# Altium schematic sheet main.SchDoc
size A4; SheetNumber: 1; SheetTotal: 12
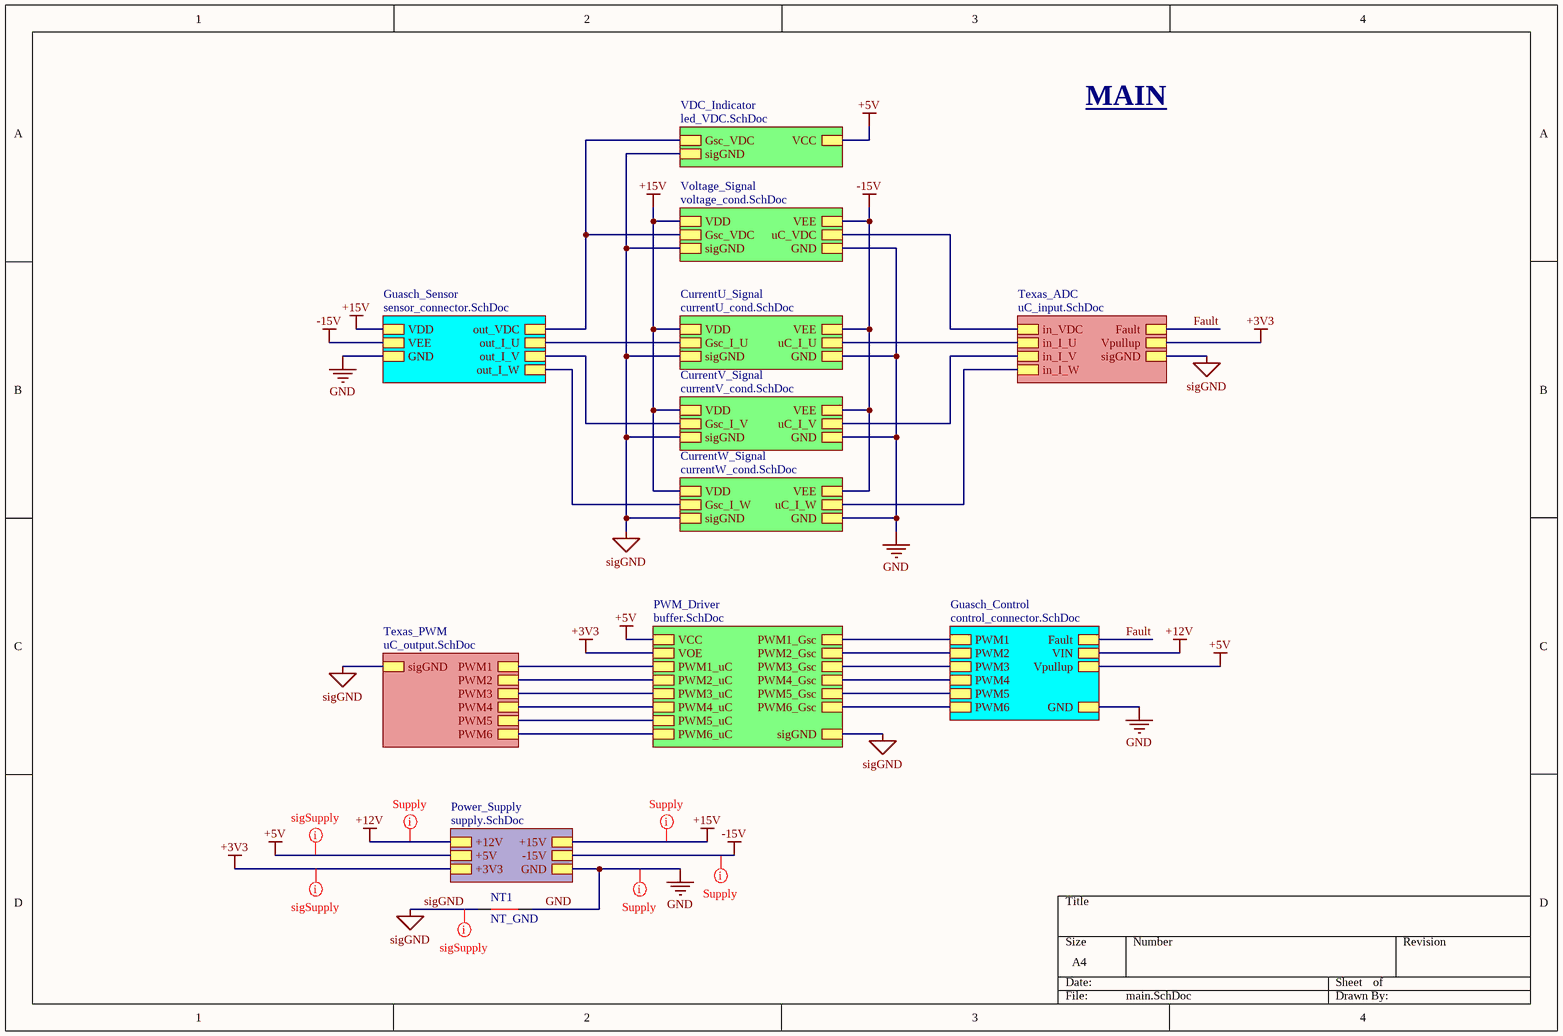
[diagram p0: main.SchDoc]

## Parts
NT1  NT_GND  [NetTie_GND]  (net tie, no BOM)

## Sub-sheets
CurrentU_Signal = currentU_cond.SchDoc: Gsc_I_U, uC_I_U, VDD, VEE, GND, sigGND
CurrentV_Signal = currentV_cond.SchDoc: Gsc_I_V, uC_I_V, VDD, VEE, GND, sigGND
CurrentW_Signal = currentW_cond.SchDoc: Gsc_I_W, uC_I_W, VDD, VEE, GND, sigGND
Guasch_Control = control_connector.SchDoc: PWM1, PWM2, PWM3, Fault, PWM4, PWM5, PWM6, VIN, Vpullup, GND
Guasch_Sensor = sensor_connector.SchDoc: out_I_U, out_I_V, out_I_W, VDD, VEE, GND, out_VDC
Power_Supply = supply.SchDoc: +15V, -15V, +12V, +5V, +3V3, GND
PWM_Driver = buffer.SchDoc: PWM1_uC, PWM2_uC, PWM3_uC, PWM4_uC, PWM5_uC, PWM6_uC, PWM1_Gsc, PWM2_Gsc, PWM3_Gsc, PWM4_Gsc, PWM5_Gsc, PWM6_Gsc, VCC, VOE, sigGND
Texas_ADC = uC_input.SchDoc: in_VDC, in_I_U, in_I_V, in_I_W, Fault, Vpullup, sigGND
Texas_PWM = uC_output.SchDoc: PWM1, PWM2, PWM3, PWM4, PWM5, PWM6, sigGND
VDC_Indicator = led_VDC.SchDoc: VCC, Gsc_VDC, sigGND
Voltage_Signal = voltage_cond.SchDoc: Gsc_VDC, uC_VDC, VDD, VEE, GND, sigGND

## Nets
+3V3: sheet PWM_Driver/VOE, sheet Texas_ADC/Vpullup, sheet Power_Supply/+3V3
+5V: sheet PWM_Driver/VCC, sheet Guasch_Control/Vpullup, sheet Power_Supply/+5V, sheet VDC_Indicator/VCC
+12V: sheet Guasch_Control/VIN, sheet Power_Supply/+12V
+15V: sheet Guasch_Sensor/VDD, sheet CurrentU_Signal/VDD, sheet Voltage_Signal/VDD, sheet CurrentV_Signal/VDD, sheet CurrentW_Signal/VDD, sheet Power_Supply/+15V
-15V: sheet Guasch_Sensor/VEE, sheet CurrentU_Signal/VEE, sheet Voltage_Signal/VEE, sheet CurrentV_Signal/VEE, sheet CurrentW_Signal/VEE, sheet Power_Supply/-15V
GND: NT1.1 ; sheet Guasch_Control/GND, sheet Guasch_Sensor/GND, sheet CurrentU_Signal/GND, sheet Voltage_Signal/GND, sheet CurrentV_Signal/GND, sheet CurrentW_Signal/GND, sheet Power_Supply/GND
sigGND: NT1.0 ; sheet PWM_Driver/sigGND, sheet CurrentU_Signal/sigGND, sheet Voltage_Signal/sigGND, sheet Texas_ADC/sigGND, sheet Texas_PWM/sigGND, sheet CurrentV_Signal/sigGND, sheet CurrentW_Signal/sigGND, sheet VDC_Indicator/sigGND
Fault: sheet Guasch_Control/Fault, sheet Texas_ADC/Fault
(unnamed): sheet PWM_Driver/PWM1_uC, sheet Texas_PWM/PWM1
(unnamed): sheet PWM_Driver/PWM2_uC, sheet Texas_PWM/PWM2
(unnamed): sheet PWM_Driver/PWM3_uC, sheet Texas_PWM/PWM3
(unnamed): sheet PWM_Driver/PWM4_uC, sheet Texas_PWM/PWM4
(unnamed): sheet PWM_Driver/PWM5_uC, sheet Texas_PWM/PWM5
(unnamed): sheet PWM_Driver/PWM6_uC, sheet Texas_PWM/PWM6
(unnamed): sheet PWM_Driver/PWM1_Gsc, sheet Guasch_Control/PWM1
(unnamed): sheet PWM_Driver/PWM2_Gsc, sheet Guasch_Control/PWM2
(unnamed): sheet PWM_Driver/PWM3_Gsc, sheet Guasch_Control/PWM3
(unnamed): sheet PWM_Driver/PWM4_Gsc, sheet Guasch_Control/PWM4
(unnamed): sheet PWM_Driver/PWM5_Gsc, sheet Guasch_Control/PWM5
(unnamed): sheet PWM_Driver/PWM6_Gsc, sheet Guasch_Control/PWM6
(unnamed): sheet Guasch_Sensor/out_I_U, sheet CurrentU_Signal/Gsc_I_U
(unnamed): sheet Guasch_Sensor/out_I_V, sheet CurrentV_Signal/Gsc_I_V
(unnamed): sheet Guasch_Sensor/out_I_W, sheet CurrentW_Signal/Gsc_I_W
(unnamed): sheet Guasch_Sensor/out_VDC, sheet Voltage_Signal/Gsc_VDC, sheet VDC_Indicator/Gsc_VDC
(unnamed): sheet CurrentU_Signal/uC_I_U, sheet Texas_ADC/in_I_U
(unnamed): sheet Voltage_Signal/uC_VDC, sheet Texas_ADC/in_VDC
(unnamed): sheet Texas_ADC/in_I_V, sheet CurrentV_Signal/uC_I_V
(unnamed): sheet Texas_ADC/in_I_W, sheet CurrentW_Signal/uC_I_W

## Layout directives
net class Supply: +12V, +15V, -15V, GND
net class sigSupply: +3V3, +5V, sigGND

## Notes on the sheet
- MAIN

## Library data of the parts
NT1 = NetTIe_GND: Net Tie for GND, at bottom layer